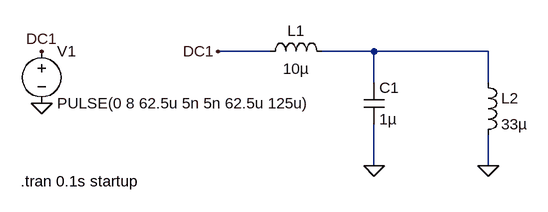
[diagram p0: schematic ClassDOutput.asc]
ClassDOutput.asc, the LTspice schematic file:
Version 4
SHEET 1 880 680
WIRE 176 192 96 192
WIRE 336 192 256 192
WIRE 512 192 336 192
WIRE 336 240 336 192
WIRE 512 240 512 192
WIRE 336 368 336 304
WIRE 512 368 512 320
FLAG 336 368 0
FLAG -176 272 0
FLAG -176 192 DC1
FLAG 96 192 DC1
FLAG 512 368 0
SYMBOL cap 320 240 R0
SYMATTR InstName C1
SYMATTR Value 1µ
SYMATTR SpiceLine V=50 Irms=3.41 Rser=0.0133158 Lser=0 mfg="KEMET" pn="C1206C105K5RAC" type="X7R"
SYMBOL voltage -176 176 R0
WINDOW 123 0 0 Left 2
WINDOW 39 0 0 Left 2
SYMATTR InstName V1
SYMATTR Value PULSE(0 8 62.5u 5n 5n 62.5u 125u)
SYMBOL ind 496 224 R0
SYMATTR InstName L2
SYMATTR Value 33µ
SYMATTR SpiceLine Ipk=3 Rser=0.089 Rpar=0 Cpar=0 mfg="Murata" pn="DFEG10040D-330M=P3"
SYMBOL ind 160 208 R270
WINDOW 0 32 56 VTop 2
WINDOW 3 5 56 VBottom 2
SYMATTR InstName L1
SYMATTR Value 10µ
SYMATTR SpiceLine Ipk=1.32 Rser=0.168 Rpar=7002 Cpar=3.18p mfg="Würth Elektronik" pn="74404041100 WE-LQS 4012"
TEXT -208 392 Left 2 !.tran 0.1s startup

The netlist it stands for:
* ClassDOutput.asc
C1 N001 0 1µ V=50 Irms=3.41 Rser=0.0133158 Lser=0 mfg="KEMET" pn="C1206C105K5RAC" type="X7R"
V1 DC1 0 PULSE(0 8 62.5u 5n 5n 62.5u 125u)
L2 N001 0 33µ Ipk=3 Rser=0.089 Rpar=0 Cpar=0 mfg="Murata" pn="DFEG10040D-330M=P3"
L1 DC1 N001 10µ Ipk=1.32 Rser=0.168 Rpar=7002 Cpar=3.18p mfg="Würth Elektronik" pn="74404041100 WE-LQS 4012"
.tran 0.1s startup
.backanno
.end